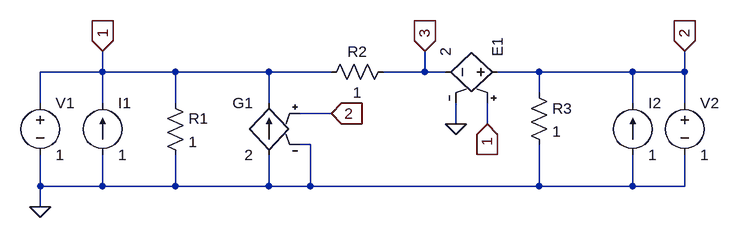
[diagram p0: schematic Two port circuit2.asc]
Two port circuit2.asc, the LTspice schematic file:
Version 4
SHEET 1 1096 680
WIRE 16 80 16 48
WIRE 16 80 -80 80
WIRE 128 80 16 80
WIRE 272 80 128 80
WIRE 368 80 272 80
WIRE 512 80 512 48
WIRE 512 80 448 80
WIRE 544 80 512 80
WIRE 688 80 624 80
WIRE 832 80 688 80
WIRE 912 80 912 48
WIRE 912 80 832 80
WIRE 688 112 688 80
WIRE -80 128 -80 80
WIRE 16 128 16 80
WIRE 128 128 128 80
WIRE 272 128 272 80
WIRE 832 128 832 80
WIRE 912 128 912 80
WIRE 368 144 320 144
WIRE 560 160 560 128
WIRE 608 160 608 128
WIRE 336 192 320 192
WIRE -80 256 -80 208
WIRE 16 256 16 208
WIRE 16 256 -80 256
WIRE 128 256 128 208
WIRE 128 256 16 256
WIRE 272 256 272 208
WIRE 272 256 128 256
WIRE 336 256 336 192
WIRE 336 256 272 256
WIRE 688 256 688 192
WIRE 688 256 336 256
WIRE 832 256 832 208
WIRE 832 256 688 256
WIRE 912 256 912 208
WIRE 912 256 832 256
WIRE -80 288 -80 256
FLAG -80 288 0
FLAG 912 48 2
IOPIN 912 48 In
FLAG 16 48 1
IOPIN 16 48 In
FLAG 512 48 3
IOPIN 512 48 In
FLAG 368 144 2
IOPIN 368 144 In
FLAG 608 160 1
IOPIN 608 160 In
FLAG 560 160 0
SYMBOL voltage -80 112 R0
WINDOW 123 0 0 Left 2
WINDOW 39 0 0 Left 2
SYMATTR InstName V1
SYMATTR Value 1
SYMBOL current 16 208 M180
WINDOW 0 24 80 Left 2
WINDOW 3 24 0 Left 2
WINDOW 123 0 0 Left 2
WINDOW 39 0 0 Left 2
SYMATTR InstName I1
SYMATTR Value 1
SYMBOL res 112 112 R0
SYMATTR InstName R1
SYMATTR Value 1
SYMBOL g 272 112 M0
SYMATTR InstName G1
SYMATTR Value 2
SYMBOL res 352 96 R270
WINDOW 0 32 56 VTop 2
WINDOW 3 0 56 VBottom 2
SYMATTR InstName R2
SYMATTR Value 1
SYMBOL e 640 80 M270
SYMATTR InstName E1
SYMATTR Value 2
SYMBOL res 672 96 R0
SYMATTR InstName R3
SYMATTR Value 1
SYMBOL voltage 912 112 R0
WINDOW 123 0 0 Left 2
WINDOW 39 0 0 Left 2
SYMATTR InstName V2
SYMATTR Value 1
SYMBOL current 832 208 M180
WINDOW 0 24 80 Left 2
WINDOW 3 24 0 Left 2
WINDOW 123 0 0 Left 2
WINDOW 39 0 0 Left 2
SYMATTR InstName I2
SYMATTR Value 1

The netlist it stands for:
* Two port circuit2.asc
V1 1 0 1
I1 0 1 1
R1 1 0 1
G1 0 1 2 0 2
R2 1 3 1
E1 2 3 1 0 2
R3 2 0 1
V2 2 0 1
I2 0 2 1
.backanno
.end